# EAGLE design MultiWiiChassis_quadlite_power (EAGLE 6.4)
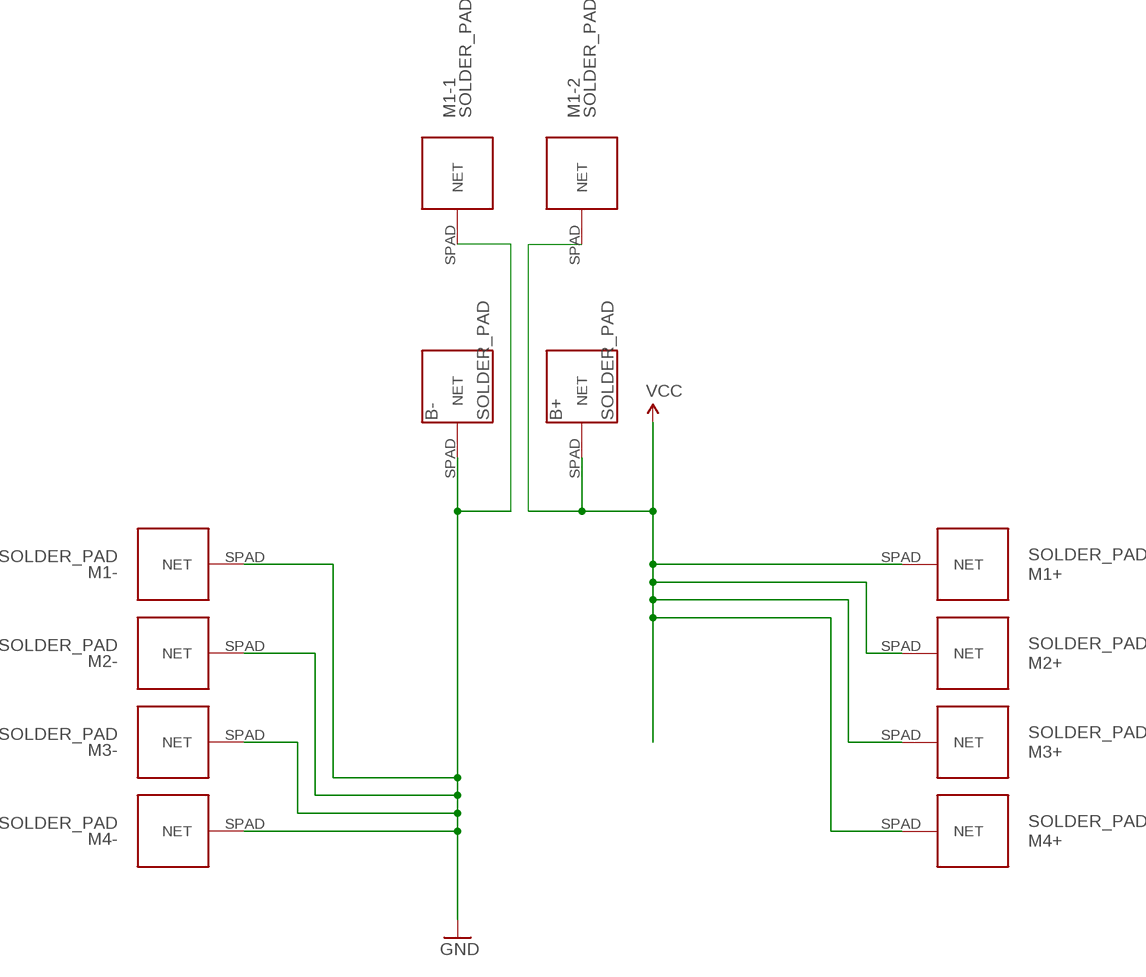
[diagram p0: schematic, sheet 1]

## Parts
B+  SOLDER_PAD  [SOLDER_PAD]
B-  SOLDER_PAD  [SOLDER_PAD]
M1+  SOLDER_PAD  [SOLDER_PAD]
M1-  SOLDER_PAD  [SOLDER_PAD]
M1-1  SOLDER_PAD  [SOLDER_PAD]
M1-2  SOLDER_PAD  [SOLDER_PAD]
M2+  SOLDER_PAD  [SOLDER_PAD]
M2-  SOLDER_PAD  [SOLDER_PAD]
M3+  SOLDER_PAD  [SOLDER_PAD]
M3-  SOLDER_PAD  [SOLDER_PAD]
M4+  SOLDER_PAD  [SOLDER_PAD]
M4-  SOLDER_PAD  [SOLDER_PAD]

## Nets
GND: B-.SPAD(NET) M1-1.SPAD(NET) M1-.SPAD(NET) M2-.SPAD(NET) M3-.SPAD(NET) M4-.SPAD(NET)
VCC: B+.SPAD(NET) M1+.SPAD(NET) M1-2.SPAD(NET) M2+.SPAD(NET) M3+.SPAD(NET) M4+.SPAD(NET)

## Library data of the parts
B+ B- M1+ M1- M1-1 M1-2 M2+ M2- M3+ M3- M4+ M4- = JCM:SOLDER_PAD

## Board
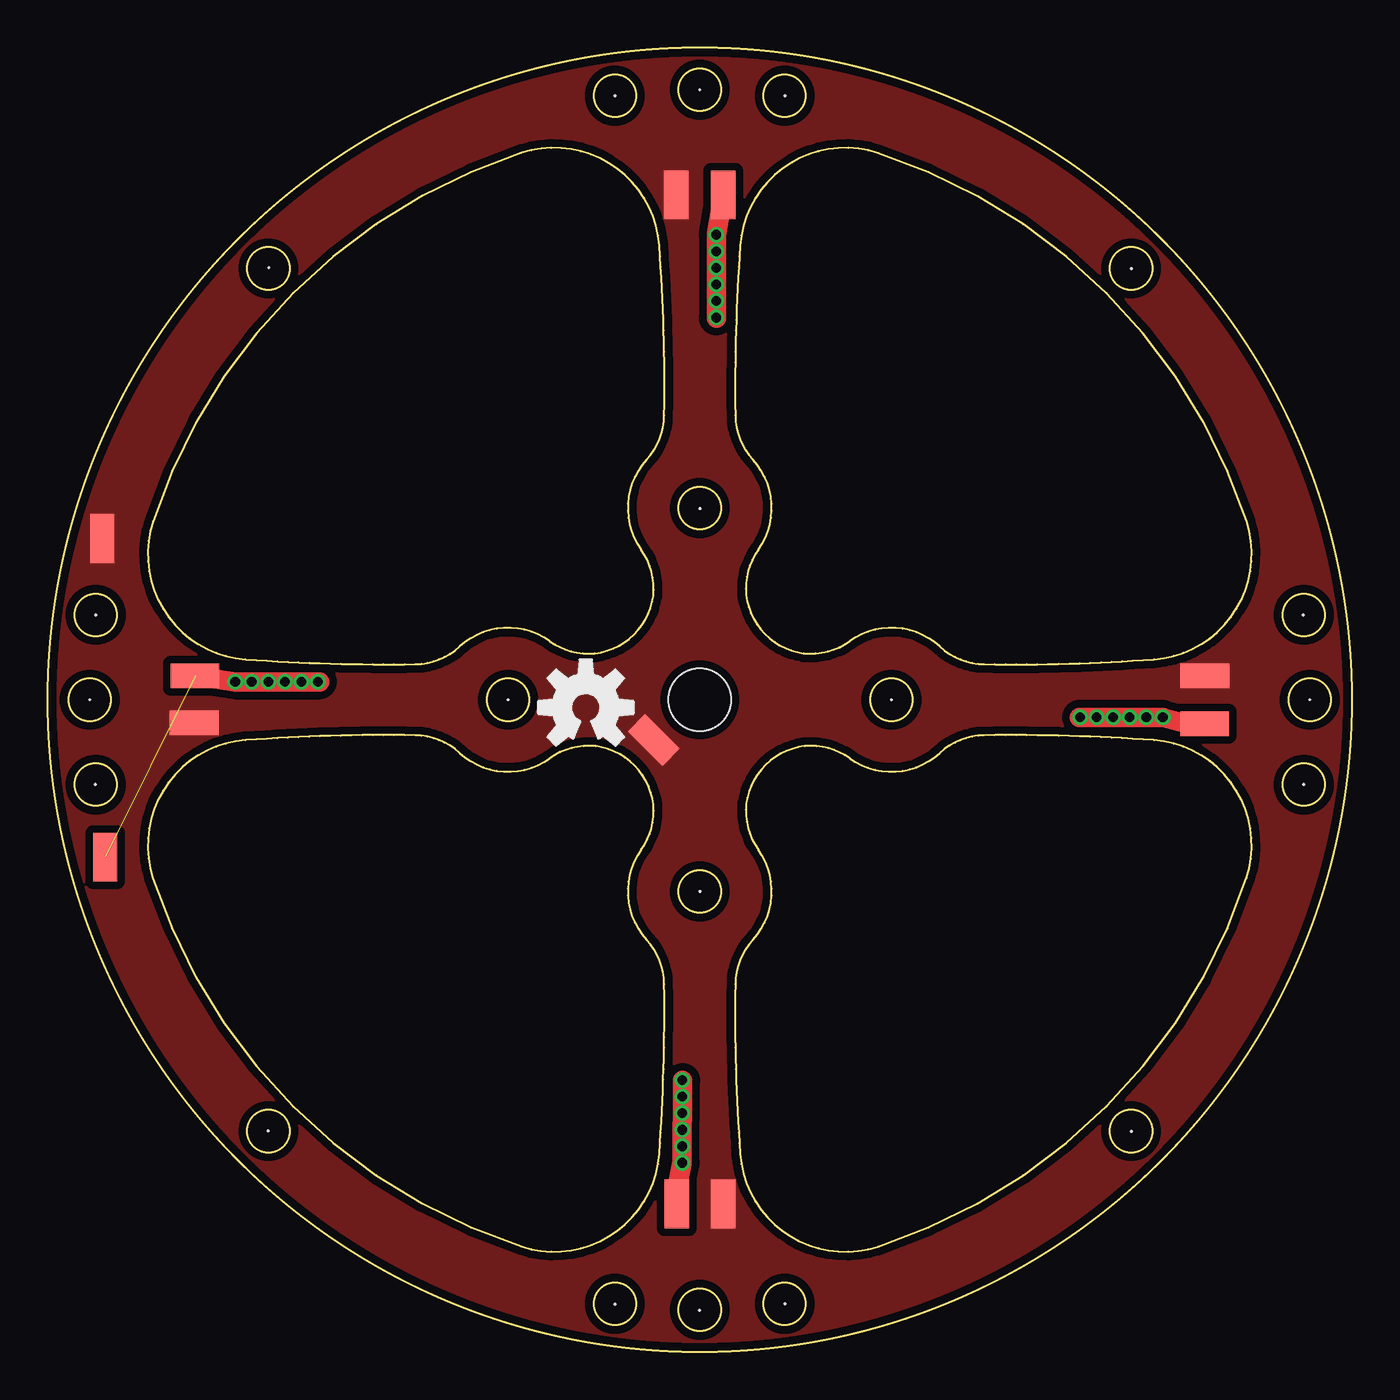
[diagram p1: board, top side]
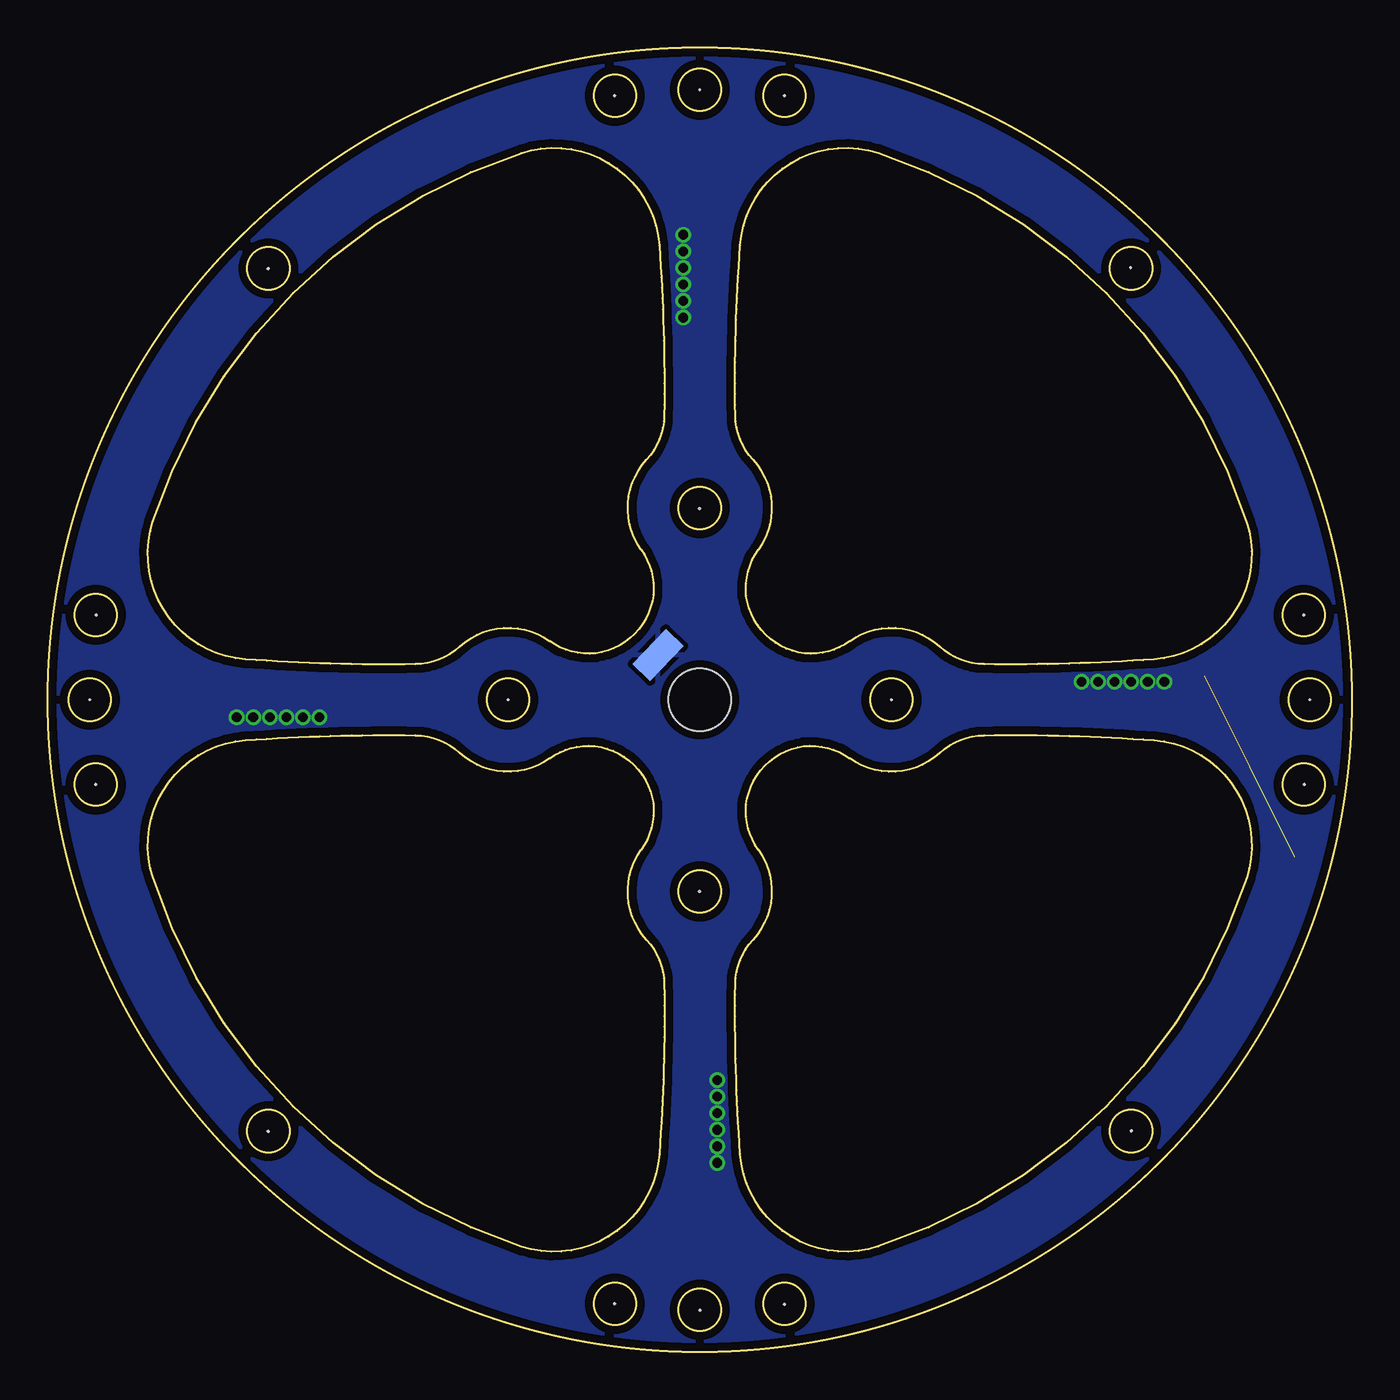
[diagram p2: board, bottom side, seen from below]

Size 68 x 68 mm. Coordinates in mm from the lower left corner, seen from the top.
Outline: 28.58,31.58 arc42 26.18,30.95 arc-78 21.47,31.23 arc42 19.16,32.15 18.61,32.15 18.05,32.16 17.5,32.16 16.95,32.16 16.39,32.15 15.84,32.14 15.29,32.13 14.74,32.12 14.18,32.1 13.63,32.08 13.08,32.05 12.52,32.03 11.97,32 11.42,31.97 10.86,31.93 10.31,31.89 arc104 5.48,24.7 arc54 24.7,5.48 arc104 31.89,10.31 31.93,10.86 31.96,11.42 32,11.97 32.03,12.52 32.05,13.08 32.08,13.63 32.1,14.18 32.11,14.74 32.13,15.29 32.14,15.84 32.15,16.4 32.15,16.95 32.16,17.5 32.16,18.06 32.15,18.61 32.15,19.16 arc42 31.23,21.47 arc-78 30.95,26.18 arc41 31.58,28.53 arc75 28.58,31.58
Outline: 35.85,19.16 35.85,18.61 35.84,18.05 35.84,17.5 35.84,16.95 35.85,16.39 35.86,15.84 35.87,15.29 35.88,14.74 35.9,14.18 35.92,13.63 35.95,13.08 35.97,12.52 36,11.97 36.03,11.42 36.07,10.86 36.11,10.31 arc104 43.3,5.48 arc54 62.52,24.7 arc104 57.69,31.89 57.14,31.93 56.58,31.96 56.03,32 55.48,32.03 54.92,32.05 54.37,32.08 53.82,32.1 53.26,32.11 52.71,32.13 52.16,32.14 51.6,32.15 51.05,32.15 50.5,32.16 49.94,32.16 49.39,32.15 48.84,32.15 arc42 46.53,31.23 arc-78 41.82,30.95 arc41 39.47,31.58 arc75 36.42,28.58 arc42 37.05,26.18 arc-78 36.77,21.47 arc42 35.85,19.16
Outline: 48.84,35.85 49.39,35.85 49.95,35.84 50.5,35.84 51.05,35.84 51.6,35.85 52.16,35.86 52.71,35.87 53.26,35.88 53.82,35.9 54.37,35.92 54.92,35.95 55.48,35.97 56.03,36 56.58,36.03 57.14,36.07 57.69,36.11 arc104 62.52,43.3 arc54 43.3,62.52 arc104 36.11,57.69 36.07,57.14 36.04,56.58 36,56.03 35.97,55.48 35.95,54.92 35.92,54.37 35.9,53.82 35.89,53.26 35.87,52.71 35.86,52.16 35.85,51.6 35.85,51.05 35.84,50.5 35.84,49.94 35.85,49.39 35.85,48.84 arc42 36.77,46.53 arc-78 37.05,41.82 arc41 36.42,39.47 arc75 39.42,36.42 arc42 41.82,37.05 arc-78 46.53,36.77 arc42 48.84,35.85
Outline: 32.15,48.84 32.15,49.39 32.16,49.95 32.16,50.5 32.16,51.05 32.15,51.6 32.14,52.16 32.13,52.71 32.12,53.26 32.1,53.82 32.08,54.37 32.05,54.92 32.03,55.48 32,56.03 31.97,56.58 31.93,57.14 31.89,57.69 arc104 24.7,62.52 arc54 5.48,43.3 arc104 10.31,36.11 10.86,36.07 11.42,36.04 11.97,36 12.52,35.97 13.08,35.95 13.63,35.92 14.18,35.9 14.74,35.89 15.29,35.87 15.84,35.86 16.4,35.85 16.95,35.85 17.5,35.84 18.06,35.84 18.61,35.85 19.16,35.85 arc42 21.47,36.77 arc-78 26.18,37.05 arc41 28.53,36.42 arc75 31.58,39.42 arc42 30.95,41.82 arc-78 31.23,46.53 arc42 32.15,48.84
Outline: circle at 34,24 radius 1.1
Outline: circle at 44,34 radius 1.1
Outline: circle at 34,44 radius 1.1
Outline: circle at 24,34 radius 1.1
Outline: circle at 29.57,2.49 radius 1.1
Outline: circle at 38.43,2.49 radius 1.1
Outline: circle at 65.51,29.57 radius 1.1
Outline: circle at 65.51,38.43 radius 1.1
Outline: circle at 11.5,56.5 radius 1.1
Outline: circle at 11.5,11.5 radius 1.1
Outline: circle at 56.5,11.5 radius 1.1
Outline: circle at 56.5,56.5 radius 1.1
Outline: circle at 38.43,65.51 radius 1.1
Outline: circle at 29.57,65.51 radius 1.1
Outline: circle at 2.49,38.43 radius 1.1
Outline: circle at 2.49,29.57 radius 1.1
Outline: circle at 34,2.18 radius 1.1
Outline: circle at 65.82,34 radius 1.1
Outline: circle at 34,65.82 radius 1.1
Outline: circle at 2.18,34 radius 1.1
Copper layers (1*16): Top 0.035mm / dielectric 1.5mm / Bottom 0.035mm
Design rules "Fusion_eagle_rule_v1.1": minimum track width 6mil, minimum drill 12mil, track to track 6mil, track to pad 6mil, pad to pad 6mil, via to via 6mil, smd to smd 0mil, copper to edge 10mil, drill to drill 10mil, minimum pad ring 10mil, minimum via ring 6mil, stop-mask expansion 2mil, vias tented up to drill 100mil, thermal gap 10mil
Holes 0.06 mm at 34,65.82 65.82,34 33.97,2.15 2.18,34 11.5,11.53 11.53,56.55 56.5,11.5 2.5,38.42 2.48,29.58 56.51,56.5 29.58,65.52 38.45,65.52 44,34 65.49,38.42 65.52,29.58 29.58,2.46 38.45,2.49 24,34 34.01,43.98 34.01,23.99
Holes 3.28 mm at 34,34
vRestrict: 3 lines

### Footprints (pad centres in the part's own frame; a part is rotated, then mirrored left to right if it is on the bottom)
SOLDER_PAD = smd 2.54 x 1.27: SPAD 0,0

### Placement (x,y rotation side)
B+  31.6,31.9 315 top
B-  36.18,36.33 46 bottom
M1+  32.78,60.34 90 top
M1-  35.22,60.34 90 top
M1-1  2.99,25.79 90 top
M1-2  2.83,42.41 90 top
M2+  7.63,32.8 0 top
M2-  7.67,35.25 0 top
M3+  35.23,7.71 90 top
M3-  32.8,7.71 90 top
M4+  60.34,35.24 0 top
M4-  60.33,32.75 0 top
U$2  [OSHW-LOGO-M]  28.05,33.59 0 top

### Tracks (layer width: path | path; a pad name or v marks a point on that pad's centre or on a via)
GND  (via drill 0.51)  (1 unrouted)
  Top 1.016: 14.16,34.94 v9.77,34.94 M2-.SPAD | 34.86,53.91 v34.86,58.26 M1-.SPAD | 33.11,14.14 v33.08,9.84 32.83,8.65 M3-.SPAD | 53.81,33.08 v58.15,33.08 59.3,32.75 M4-.SPAD
  other vias: 10.63,34.94 11.49,34.94 12.36,34.94 13.22,34.94 14.08,34.94 34.86,53.94 34.86,54.8 34.86,55.66 34.86,56.53 34.86,57.39 53.84,33.08 54.7,33.08 55.56,33.08 56.43,33.08 57.29,33.08 33.08,10.71 33.08,11.57 33.08,12.43 33.08,13.3 33.08,14.16
  pour Bottom (isolate 0.406): -4,72.2 72.2,72.2 72.1,-4.1 -4.1,-4.1
VCC
  pour Top (isolate 0.406, no thermals): 72.2,72.2 72.1,-4.1 -4.1,-4.1 -4,72.2

### Text on the board
tDocu: Quad Power v2 | + | Engineering LLC | J Moreland | - | MultiWiiChassis